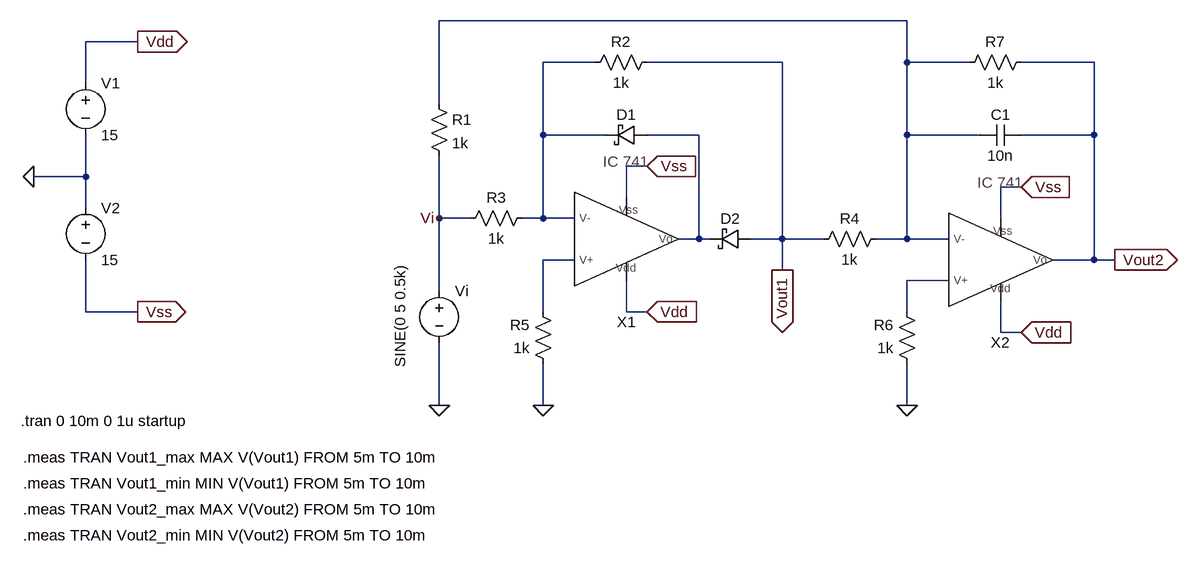
[diagram p0: schematic precision_rectifier.asc]
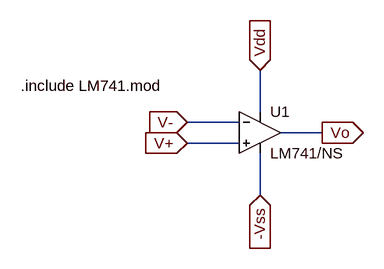
[diagram p1: sub-circuit ic741.asc]
precision_rectifier.asc, the LTspice schematic file:
Version 4
SHEET 1 976 680
WIRE 528 -224 -192 -224
WIRE -656 -192 -736 -192
WIRE 48 -160 -32 -160
WIRE 336 -160 128 -160
WIRE 528 -160 528 -224
WIRE 624 -160 528 -160
WIRE 816 -160 704 -160
WIRE -736 -128 -736 -192
WIRE -192 -96 -192 -224
WIRE -32 -48 -32 -160
WIRE 64 -48 -32 -48
WIRE 208 -48 128 -48
WIRE 528 -48 528 -160
WIRE 640 -48 528 -48
WIRE 816 -48 816 -160
WIRE 816 -48 704 -48
WIRE 128 0 96 0
WIRE -736 16 -736 -48
WIRE -736 16 -816 16
WIRE 704 32 672 32
WIRE 96 48 96 0
WIRE -736 64 -736 16
WIRE -192 80 -192 -16
WIRE -144 80 -192 80
WIRE -32 80 -32 -48
WIRE -32 80 -64 80
WIRE 16 80 -32 80
WIRE 672 80 672 32
WIRE 208 112 208 -48
WIRE 208 112 176 112
WIRE 224 112 208 112
WIRE 336 112 336 -160
WIRE 336 112 288 112
WIRE 400 112 336 112
WIRE 528 112 528 -48
WIRE 528 112 480 112
WIRE 592 112 528 112
WIRE 16 144 -32 144
WIRE 816 144 816 -48
WIRE 816 144 752 144
WIRE 848 144 816 144
WIRE 336 160 336 112
WIRE 592 176 528 176
WIRE -192 192 -192 80
WIRE -736 224 -736 144
WIRE -656 224 -736 224
WIRE -32 224 -32 144
WIRE 96 224 96 176
WIRE 128 224 96 224
WIRE 528 224 528 176
WIRE 672 256 672 208
WIRE 704 256 672 256
WIRE -192 368 -192 272
WIRE -32 368 -32 304
WIRE 528 368 528 304
FLAG 336 160 Vout1
IOPIN 336 160 Out
FLAG 848 144 Vout2
IOPIN 848 144 Out
FLAG -32 368 0
FLAG 528 368 0
FLAG -192 368 0
FLAG -816 16 0
FLAG -656 -192 Vdd
IOPIN -656 -192 Out
FLAG -656 224 Vss
IOPIN -656 224 Out
FLAG 128 224 Vdd
IOPIN 128 224 In
FLAG 704 256 Vdd
IOPIN 704 256 In
FLAG 128 0 Vss
IOPIN 128 0 In
FLAG 704 32 Vss
IOPIN 704 32 In
FLAG -192 80 Vi
SYMBOL schottky 128 -64 R90
WINDOW 0 0 32 VBottom 2
WINDOW 3 32 32 Invisible 2
SYMATTR InstName D1
SYMATTR Value RSX051VA-30
SYMATTR Description Diode
SYMATTR Type diode
SYMBOL res 144 -176 R90
WINDOW 0 0 56 VBottom 2
WINDOW 3 32 56 VTop 2
SYMATTR InstName R2
SYMATTR Value 1k
SYMBOL res 496 96 R90
WINDOW 0 0 56 VBottom 2
WINDOW 3 32 56 VTop 2
SYMATTR InstName R4
SYMATTR Value 1k
SYMBOL res -208 -112 R0
SYMATTR InstName R1
SYMATTR Value 1k
SYMBOL res -48 64 R90
WINDOW 0 0 56 VBottom 2
WINDOW 3 32 56 VTop 2
SYMATTR InstName R3
SYMATTR Value 1k
SYMBOL res -16 320 R180
WINDOW 0 36 76 Left 2
WINDOW 3 36 40 Left 2
SYMATTR InstName R5
SYMATTR Value 1k
SYMBOL res 544 320 R180
WINDOW 0 36 76 Left 2
WINDOW 3 36 40 Left 2
SYMATTR InstName R6
SYMATTR Value 1k
SYMBOL cap 704 -64 R90
WINDOW 0 0 32 VBottom 2
WINDOW 3 32 32 VTop 2
SYMATTR InstName C1
SYMATTR Value 10n
SYMBOL res 720 -176 R90
WINDOW 0 0 56 VBottom 2
WINDOW 3 32 56 VTop 2
SYMATTR InstName R7
SYMATTR Value 1k
SYMBOL voltage -736 -144 R0
WINDOW 123 0 0 Left 0
WINDOW 39 0 0 Left 0
SYMATTR InstName V1
SYMATTR Value 15
SYMBOL voltage -736 48 R0
WINDOW 123 0 0 Left 0
WINDOW 39 0 0 Left 0
SYMATTR InstName V2
SYMATTR Value 15
SYMBOL voltage -192 176 R0
WINDOW 3 -60 -24 VRight 2
WINDOW 123 0 0 Left 0
WINDOW 39 0 0 Left 0
SYMATTR InstName Vi
SYMATTR Value SINE(0 5 0.5k)
SYMBOL IC741 96 96 M180
SYMATTR InstName X1
SYMBOL IC741 672 128 M180
SYMATTR InstName X2
SYMBOL schottky 288 96 R90
WINDOW 0 0 32 VBottom 2
WINDOW 3 32 32 Invisible 2
SYMATTR InstName D2
SYMATTR Value RSX051VA-30
SYMATTR Description Diode
SYMATTR Type diode
TEXT -836 392 Left 2 !.tran 0 10m 0 1u startup
TEXT -832 448 Left 2 !.meas TRAN Vout1_max MAX V(Vout1) FROM 5m TO 10m
TEXT -832 488 Left 2 !.meas TRAN Vout1_min MIN V(Vout1) FROM 5m TO 10m
TEXT -832 528 Left 2 !.meas TRAN Vout2_max MAX V(Vout2) FROM 5m TO 10m
TEXT -832 568 Left 2 !.meas TRAN Vout2_min MIN V(Vout2) FROM 5m TO 10m

ic741.asc, the sub-circuit schematic file:
Version 4
SHEET 1 880 680
WIRE 368 128 368 64
WIRE 336 144 256 144
WIRE 464 160 400 160
WIRE 336 176 256 176
WIRE 368 256 368 192
FLAG 464 160 Vo
IOPIN 464 160 Out
FLAG 368 64 Vdd
IOPIN 368 64 In
FLAG 368 256 -Vss
IOPIN 368 256 In
FLAG 256 176 V+
IOPIN 256 176 In
FLAG 256 144 V-
IOPIN 256 144 In
SYMBOL OpAmps\\opamp2 368 96 R0
SYMATTR InstName U1
SYMATTR Value LM741/NS
TEXT 0 88 Left 2 !.include LM741.mod

The netlist it stands for:
* precision_rectifier.asc
D1 N003 N002 RSX051VA-30
R2 Vout1 N002 1k
R4 N001 Vout1 1k
R1 N001 Vi 1k
R3 N002 Vi 1k
R5 0 N004 1k
R6 0 N005 1k
C1 Vout2 N001 10n
R7 Vout2 N001 1k
V1 Vdd 0 15
V2 0 Vss 15
Vi Vi 0 SINE(0 5 0.5k)
XX1 Vss N004 N002 Vdd N003 ic741
XX2 Vss N005 N001 Vdd Vout2 ic741
D2 Vout1 N003 RSX051VA-30

* block symbol definitions
.subckt ic741 -Vss V+ V- Vdd Vo
XU1 V+ V- Vdd -Vss Vo LM741/NS  ; pins In+ In- V+ V- OUT
.include LM741.mod
.ends ic741

.model D D
.lib standard.dio
.tran 0 10m 0 1u startup
.meas TRAN Vout1_max MAX V(Vout1) FROM 5m TO 10m
.meas TRAN Vout1_min MIN V(Vout1) FROM 5m TO 10m
.meas TRAN Vout2_max MAX V(Vout2) FROM 5m TO 10m
.meas TRAN Vout2_min MIN V(Vout2) FROM 5m TO 10m
.backanno
.end